# EAGLE design Dual_linear_VCA_chip_v2.1 (EAGLE 7.7.0)
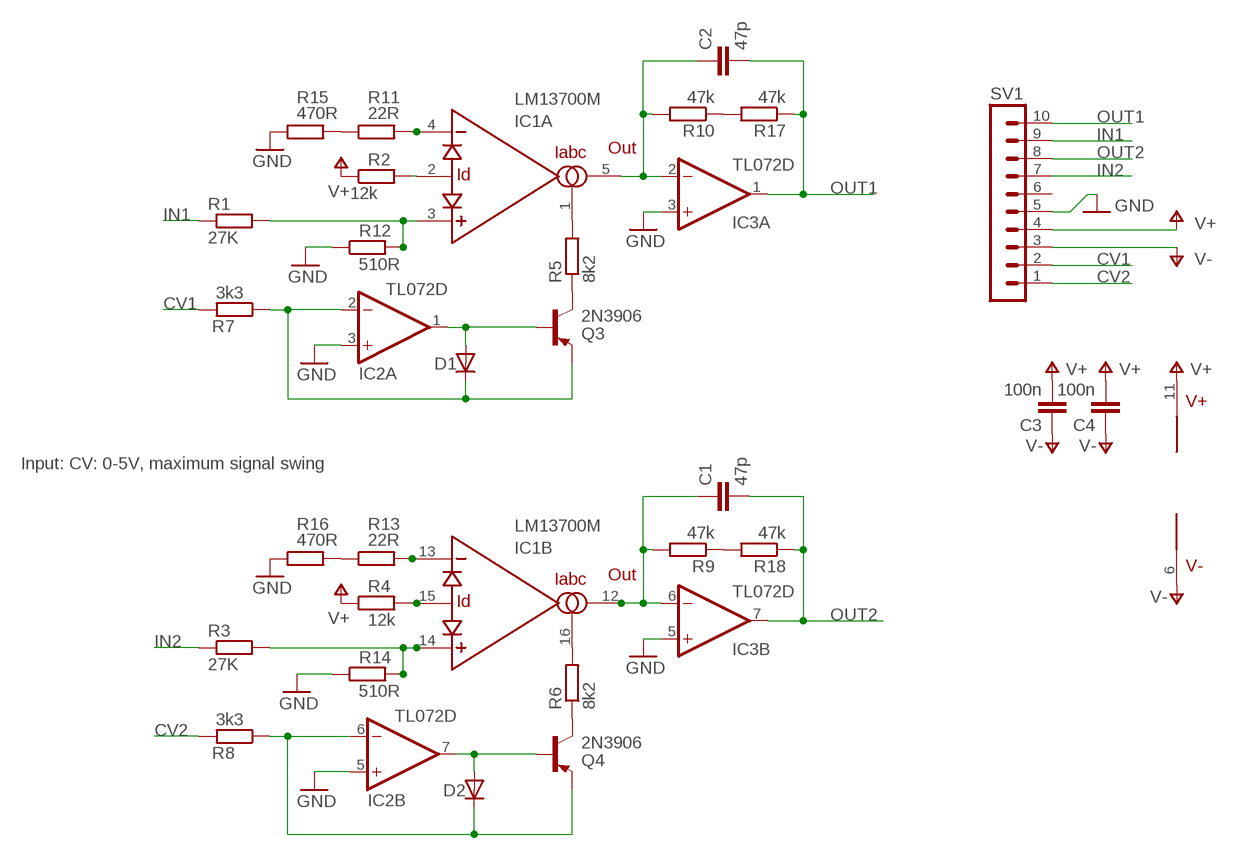
[diagram p0: schematic, sheet 1]

## Parts
C1  47p  C-EUC0805  [C0805]
C2  47p  C-EUC0805  [C0805]
C3  100n  C-EUC0805  [C0805]
C4  100n  C-EUC0805  [C0805]
D1  DIODE-SOD80C  [SOD80C]
D2  DIODE-SOD80C  [SOD80C]
IC1  LM13700M  [SO16]
IC2  TL072D  [SO08]
IC3  TL072D  [SO08]
Q3  2N3906  [TO92]
Q4  2N3906  [TO92]
R1  27K  R-EU_R0805  [R0805]
R2  12k  R-EU_R0805  [R0805]
R3  27K  R-EU_R0805  [R0805]
R4  12k  R-EU_R0805  [R0805]
R5  8k2  R-EU_R0805  [R0805]
R6  8k2  R-EU_R0805  [R0805]
R7  3k3  R-EU_R0805  [R0805]
R8  3k3  R-EU_R0805  [R0805]
R9  47k  R-EU_R0805  [R0805]
R10  47k  R-EU_R0805  [R0805]
R11  22R  R-EU_R0805  [R0805]
R12  510R  R-EU_R0805  [R0805]
R13  22R  R-EU_R0805  [R0805]
R14  510R  R-EU_R0805  [R0805]
R15  470R  R-EU_R0805  [R0805]
R16  470R  R-EU_R0805  [R0805]
R17  47k  R-EU_R0805  [R0805]
R18  47k  R-EU_R0805  [R0805]
SV1  MA10-1  [MA10-1]

## Nets
CV1: R7.2 SV1.2
CV2: R8.2 SV1.1
GND: IC2.3(A:+IN) IC2.5(B:+IN) IC3.3(A:+IN) IC3.5(B:+IN) R12.1 R14.1 R15.1 R16.1 SV1.5
IN1: R1.1 SV1.9
IN2: R3.1 SV1.7
N$1: Q3.1(C) R5.1
N$2: Q4.1(C) R6.1
N$3: D1.C IC2.2(A:-IN) Q3.3(E) R7.1
N$4: IC1.1(A:IABC) R5.2
N$5: R11.1 R15.2
N$6: IC1.2(A:ID) R2.2
N$7: R13.1 R16.2
N$8: D2.A IC2.7(B:OUT) Q4.2(B)
N$9: C2.1 IC1.5(A:OUT) IC3.2(A:-IN) R10.2
N$10: D1.A IC2.1(A:OUT) Q3.2(B)
N$11: D2.C IC2.6(B:-IN) Q4.3(E) R8.1
N$13: R10.1 R17.2
N$14: IC1.16(B:IABC) R6.2
N$16: R9.1 R18.2
N$17: IC1.15(B:ID) R4.2
N$21: C1.1 IC1.12(B:OUT) IC3.6(B:-IN) R9.2
OUT1: C2.2 IC3.1(A:OUT) R17.1 SV1.10
OUT2: C1.2 IC3.7(B:OUT) R18.1 SV1.8
TRIM1+: IC1.3(A:+IN) R1.2 R12.2
TRIM1-: IC1.4(A:-IN) R11.2
TRIM2+: IC1.14(B:+IN) R3.2 R14.2
TRIM2-: IC1.13(B:-IN) R13.2
V+: C3.2 C4.2 IC1.11(V+) R2.1 R4.1 SV1.4
V-: C3.1 C4.1 IC1.6(V-) SV1.3
Unconnected: IC1.7(IN) IC1.8(OUT) IC1.9(OUT) IC1.10(IN) SV1.6

## Notes on the sheet
- Input: CV: 0-5V, maximum signal swing

## Power pins joined to a net without a drawn wire
V+: IC2.8(P:V+) IC3.8(P:V+)
V-: IC2.4(P:V-) IC3.4(P:V-)

## Library data of the parts
C1-C4 = resistor:C-EU: CAPACITOR, European symbol
D1 D2 = diode:DIODE-: DIODE
IC1 = synthdiy:LM13700: National Dual OTA with buffers.
IC2 IC3 = linear:TL072: OP AMP
Q3 Q4 = transistor-pnp:2N3906: PNP Transistor
R1-R18 = resistor:R-EU_: RESISTOR, European symbol
SV1 = con-lstb:MA10-1: PIN HEADER; OC_FARNELL: unknown; OC_NEWARK: unknown

## Board
v1.1: Fixed mixed up output pins
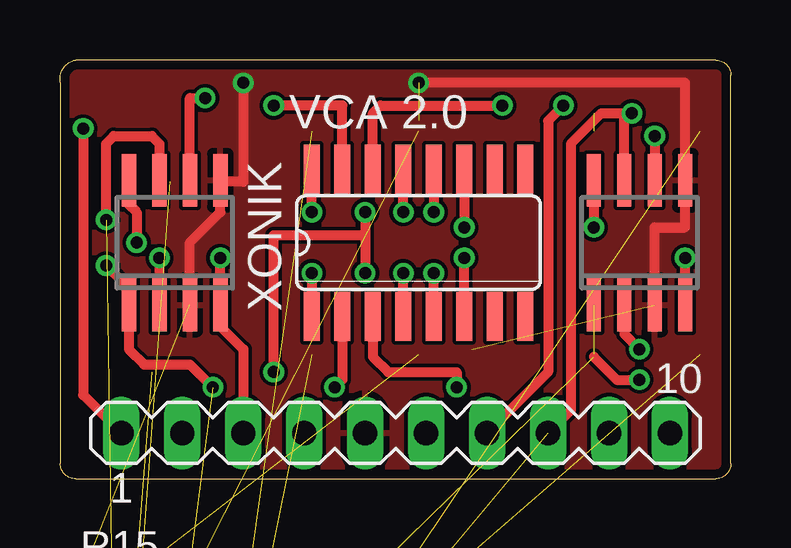
[diagram p1: board, top side]
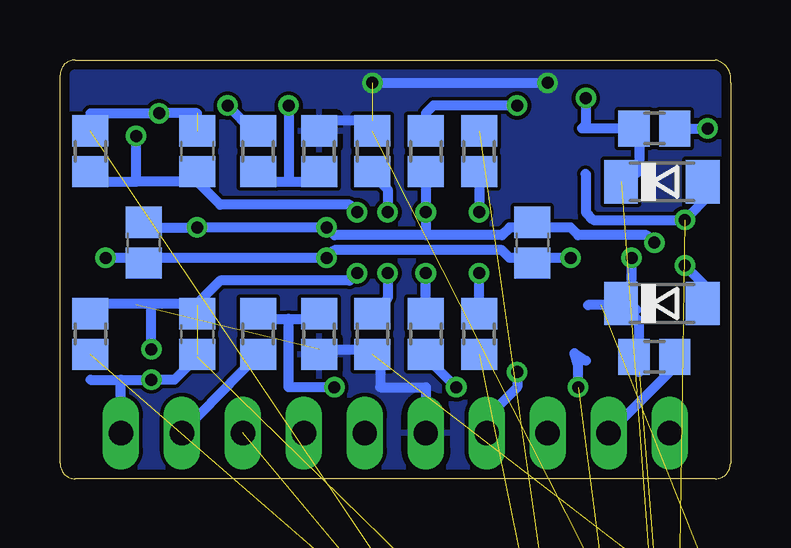
[diagram p2: board, bottom side, seen from below]

Size 27.96 x 17.46 mm. Coordinates in mm from the lower left corner, seen from the top.
Outline: 0.65,0 27.32,0 arc90 27.96,0.64 27.96,16.83 arc90 27.32,17.46 0.65,17.46 arc90 0.02,16.51 0.02,0.64 arc90 0.65,0
Copper layers (1*16): Top 0.0356mm / dielectric 1.5011mm / Bottom 0.0356mm
Design rules "default": minimum track width 6mil, minimum drill 13mil, track to track 6mil, track to pad 6mil, pad to pad 6mil, via to via 6mil, smd to smd 6mil, copper to edge 15mil, drill to drill 6mil, minimum pad ring 7mil, minimum via ring 7mil, stop-mask expansion 3mil, vias tented up to drill 0mil, thermal gap 10mil

### Footprints (pad centres in the part's own frame; a part is rotated, then mirrored left to right if it is on the bottom)
C0805 = smd 1.3 x 1.5: 1 -0.85,0; 2 0.85,0
SOD80C = smd 1.4 x 1.8: A 1.7,0; C -1.7,0
SO16 = smd 0.66 x 2.032: 1 -4.445,-3.073; 2 -3.175,-3.073; 3 -1.905,-3.073; 4 -0.635,-3.073; 5 0.635,-3.073; 6 1.905,-3.073; 7 3.175,-3.073; 8 4.445,-3.073; 9 4.445,3.073; 10 3.175,3.073; 11 1.905,3.073; 12 0.635,3.073; 13 -0.635,3.073; 14 -1.905,3.073; 15 -3.175,3.073; 16 -4.445,3.073
SO08 = smd 0.6 x 2.2: 1 -1.905,-2.6; 2 -0.635,-2.6; 3 0.635,-2.6; 4 1.905,-2.6; 5 1.905,2.6; 6 0.635,2.6; 7 -0.635,2.6; 8 -1.905,2.6
TO92 = drill 0.813 octagon: 1 1.27,0; 2 0,1.905; 3 -1.27,0
R0805 = smd 1.3 x 1.5: 1 -0.85,0; 2 0.85,0
MA10-1 = drill 1.016 long: 1 -11.43,0; 2 -8.89,0; 3 -6.35,0; 4 -3.81,0; 5 -1.27,0; 6 1.27,0; 7 3.81,0; 8 6.35,0; 9 8.89,0; 10 11.43,0

### Placement (x,y rotation side)
C1  22.24,13.65 90 bottom
C2  22.24,6.03 270 bottom
C3  8.27,9.84 90 bottom
C4  24.46,9.84 90 bottom
D1  2.87,7.3 0 bottom
D2  2.87,12.38 0 bottom
IC1  14.94,9.84 0 top
IC2  4.78,9.84 0 top
IC3  24.15,9.84 0 top
Q3  2.56,-27.62 0 top  (outside the outline)
Q4  2.56,-32.38 0 top  (outside the outline)
R1  19.7,6.03 90 bottom
R2  12.72,6.03 270 bottom
R3  19.7,13.65 270 bottom
R4  12.72,13.65 90 bottom
R5  10.49,6.03 90 bottom
R6  10.49,13.65 270 bottom
R7  3.19,5.08 0 bottom
R8  3.19,14.61 0 bottom
R9  26.69,13.65 270 bottom
R10  26.69,6.03 90 bottom
R11  14.94,6.03 90 bottom
R12  17.16,6.03 90 bottom
R13  14.94,13.65 270 bottom
R14  17.16,13.65 270 bottom
R15  1.6,-4.45 0 top  (outside the outline)
R16  1.6,-10.16 0 top  (outside the outline)
R17  1.6,-15.88 0 top  (outside the outline)
R18  1.6,-21.59 0 top  (outside the outline)
SV1  13.99,1.91 0 top

### Tracks (layer width: path | path; a pad name or v marks a point on that pad's centre or on a via)
CV1
  Bottom 0.406: R7.2 2.24,4.76 SV1.2
CV2  (via drill 0.5)
  Top 0.406: v0.97,14.61 0.97,3.49 SV1.1
  Bottom 0.406: R8.2 v0.97,14.61
GND  (via drill 0.5)  (4 unrouted)
  Top 0.406: IC3.3 24.78,10.48 26.05,10.48 IC3.5 26.05,16.51 v14.94,16.51 | IC2.3 5.41,9.84 6.68,11.11 IC2.5 6.74,12.38 7.64,12.38 v7.64,16.51
  Bottom 0.406: 14.94,14.92 16.74,14.92 R14.1 | v14.94,16.51 v7.64,16.51 | R12.1 17.16,5.4 14.62,5.4 14.62,3.81 12.72,3.81 SV1.5
  pour Top: 0.02,22.86 34.31,22.86 34.31,0 0.02,0
  pour Bottom: -0.3,22.86 34.31,22.86 33.99,0 0.02,0
IN1
  Bottom 0.406: R1.1 SV1.9
IN2  (via drill 0.5)
  Top 0.406: v20.97,15.56 20.34,14.92 20.34,4.45 SV1.7
  Bottom 0.406: R3.1 19.92,14.5 v20.97,15.56
N$1  (1 unrouted)
N$2  (1 unrouted)
N$3  (via drill 0.5)  (1 unrouted)
  Top 0.406: v4.14,9.21 IC2.2
  Bottom 0.406: R7.1 4.04,4.55 3.83,4.76 | 3.83,4.76 3.83,4.45 | 3.83,4.76 3.83,6.55 D1.C 3.94,7.04 IC2.2 | IC2.2 5.96,7.24 | IC2.2 v4.14,9.21
N$4  (via drill 0.5)
  Top 0.406: v10.49,8.57 IC1.1
  Bottom 0.406: R5.2 v10.49,8.57
N$5  (1 unrouted)
N$6  (via drill 0.5)
  Top 0.406: IC1.2 11.76,4.13 v11.45,3.81
  Bottom 0.406: v11.45,3.81 12.4,4.76 12.72,4.76 R2.2
N$7  (1 unrouted)
N$8  (via drill 0.5)  (1 unrouted)
  Top 0.406: v1.92,10.79 1.92,13.97 2.24,14.29 3.83,14.29 4.14,13.97 IC2.7
  Bottom 0.406: 6.05,12.7 6.05,11.11 5.73,10.79 v1.92,10.79 0.86,11.86 D2.A
N$9  (via drill 0.5)
  Top 0.406: IC1.5 v15.57,8.57 | IC3.2 23.51,6.03 v24.15,5.4
  Bottom 0.406: v15.57,8.57 15.89,8.26 21.29,8.26 22.24,7.3 C2.1 22.66,7.3 24.15,7.3 | R10.2 26.58,7.3 24.15,7.3 | v24.15,5.4 24.15,7.3
N$10  (via drill 0.5)  (1 unrouted)
  Top 0.406: v1.92,8.89 2.87,7.94 IC2.1 2.87,5.4 3.51,4.76 5.41,4.76 v6.37,3.81
  Bottom 0.406: D1.A 0.86,7.83 v1.92,8.89 | v6.37,3.81 6.37,4.76 6.52,5.23 6.05,4.91
N$11  (via drill 0.5)  (1 unrouted)
  Top 0.406: IC2.6 5.41,15.88 v6.05,15.88
  Bottom 0.406: v6.05,15.88 6.05,14.77 6.22,14.61 R8.1 3.94,14.82 3.93,14.82 3.83,14.92 3.83,12.81 D2.C
N$13  (1 unrouted)
N$14  (via drill 0.5)
  Top 0.406: v10.49,11.11 IC1.16
  Bottom 0.406: R6.2 v10.49,11.11
N$16  (1 unrouted)
N$17  (via drill 0.5)
  Top 0.406: IC1.15 11.76,15.56 v8.91,15.56
  Bottom 0.406: v8.91,15.56 12.4,15.56 12.72,15.24 12.72,14.92 R4.2
N$21  (via drill 0.5)
  Top 0.406: IC1.12 v15.57,11.11 | v24.78,14.29 IC3.6
  Bottom 0.406: v15.57,11.11 15.89,11.43 21.29,11.43 22.24,12.38 | C1.1 22.24,12.38 | R9.2 26.9,12.38 24.78,12.38 | 22.24,12.38 24.78,12.38 | 24.78,12.38 v24.78,14.29
OUT1  (via drill 0.5)  (2 unrouted)
  Top 0.406: 22.24,5.08 23.19,4.13 v24.15,4.13
  Bottom 0.406: C2.2 22.24,5.08 23.19,4.13 v24.15,4.13 25.42,4.13 | 26.69,4.13 25.42,4.13 | SV1.10 25.42,4.13
OUT2  (via drill 0.5)  (2 unrouted)
  Top 0.406: IC3.7 23.51,15.24 v23.83,15.24 22.56,15.24 21.29,13.97 21.29,2.86 SV1.8
  Bottom 0.406: 22.24,15.24 v23.83,15.24 26.69,15.24
TRIM1+  (via drill 0.5)
  Top 0.406: IC1.3 13.03,5.08 13.67,4.45 16.53,4.45 v16.53,3.81
  Bottom 0.406: v16.53,3.81 18.43,3.81 18.43,6.67 | 18.43,6.67 17.38,6.67 R12.2 | R1.2 19.7,6.67 18.43,6.67
TRIM1-  (via drill 0.5)
  Top 0.406: IC1.4 v14.3,8.57
  Bottom 0.406: v14.3,8.57 14.3,7.52 R11.2
TRIM2+  (via drill 0.5)
  Top 0.406: IC1.14 13.03,15.24 13.35,15.56 v18.43,15.56
  Bottom 0.406: 18.43,15.77 v18.43,15.56 18.43,12.38 | 18.43,12.38 17.16,12.38 R14.2 | R3.2 19.7,12.38 18.43,12.38
TRIM2-  (via drill 0.5)
  Top 0.406: v14.3,11.11 IC1.13
  Bottom 0.406: R13.2 14.94,12.7 14.3,12.06 v14.3,11.11
V+  (via drill 0.5)
  Top 0.406: IC1.11 v16.84,10.48 | IC3.8 v22.24,10.48 | IC2.8 2.87,11.43 3.19,11.11 v3.19,9.84 | v8.91,4.45 8.91,10.16 12.72,10.16 | v12.72,11.11 12.72,10.16 | 12.72,10.16 v12.72,8.57
  Bottom 0.406: 12.72,10.16 9.54,10.16 9.22,10.48 8.59,10.48 C3.2 8.37,10.48 6.68,10.48 6.37,10.16 3.51,10.16 v3.19,9.84 | 12.72,10.16 v12.72,11.11 R4.1 | 12.72,10.16 16.53,10.16 v16.84,10.48 v22.24,10.48 24.15,10.48 C4.2 24.25,10.79 | R2.1 v12.72,8.57 | v8.91,4.45 8.91,3.81 10.18,2.54 SV1.4
V-  (via drill 0.5)
  Top 0.406: IC1.6 v16.84,9.21 | IC3.4 v26.05,9.21 | v6.68,9.21 IC2.4 6.68,6.35 7.64,5.4 SV1.3
  Bottom 0.406: 23.93,9.21 v16.84,9.21 16.53,9.53 9.54,9.53 9.22,9.21 8.59,9.21 C3.1 8.37,9.21 v6.68,9.21 | 23.93,9.21 C4.1 24.15,9.21 | 23.93,9.21 24.15,9.21 | 24.15,9.21 v26.05,9.21

### Text on the board
tNames: VCA 2.0 | XONIK